# Altium schematic sheet Peripherals.SchDoc
size A
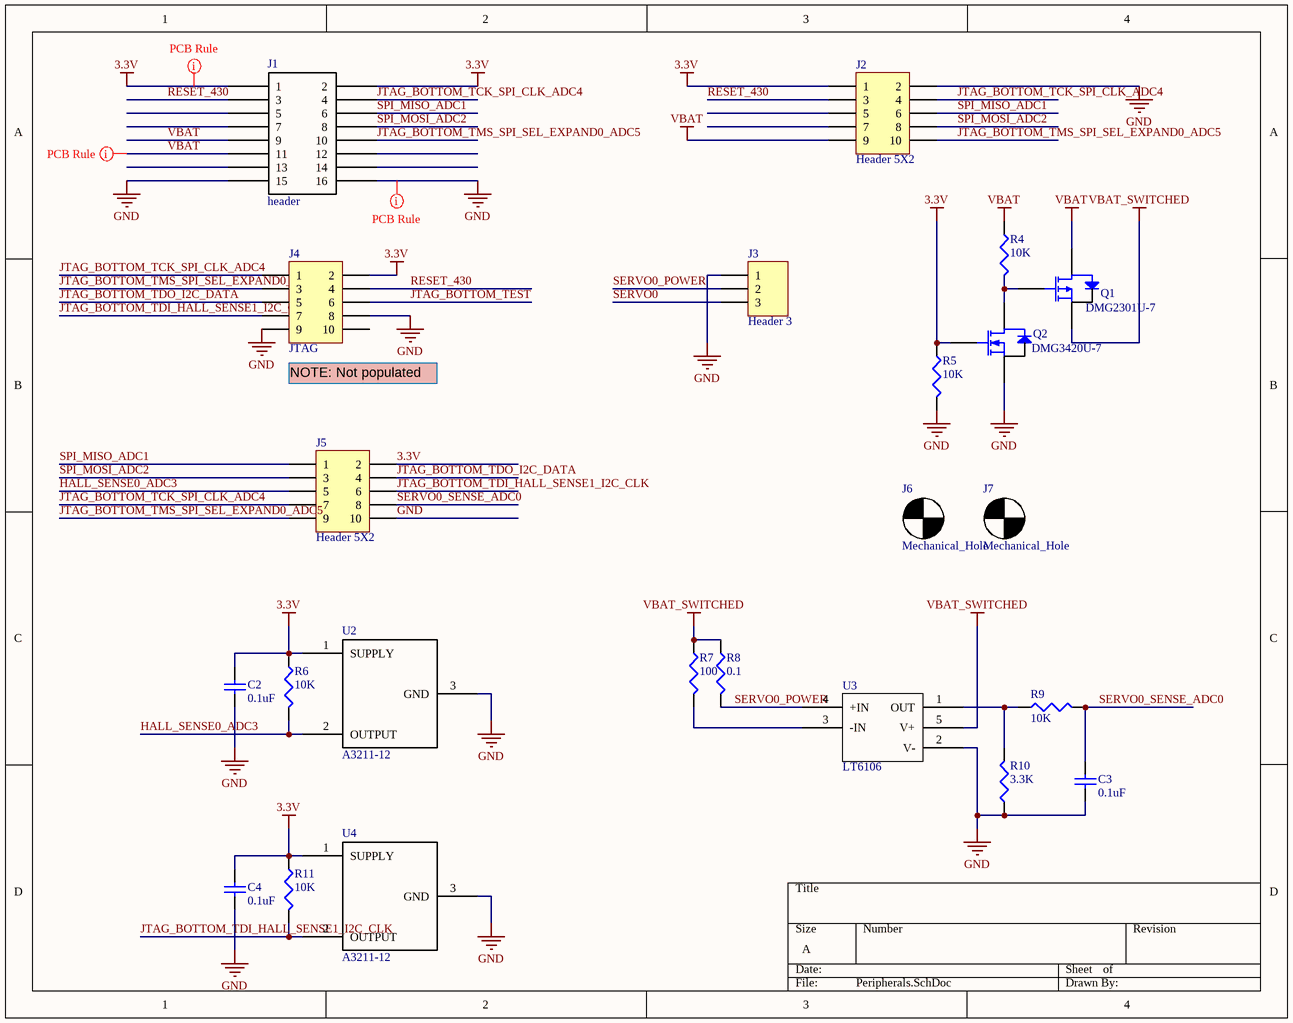
[diagram p0: Peripherals.SchDoc]

## Parts
C2  value 0.1uF  [CAPC1005L]  (hidden comment: Cap Semi)
C3  value 0.1uF  [CAPC1005L]  (hidden comment: Cap Semi)
C4  value 0.1uF  [CAPC1005L]  (hidden comment: Cap Semi)
J1  header  [HEADERSM 8X2]
J2  Header 5X2  [HDR2X5]
J3  Header 3  [HDR1X3]
J4  JTAG  [HDR2X5]
J5  Header 5X2  [HDR2X5]
J6  Mechanical_Hole  [#4_Screw_Hole]
J7  Mechanical_Hole  [#4_Screw_Hole]
Q1  DMG2301U-7  [SOT-23]
Q2  DMG3420U-7  [SOT-23]
R4  value 10K  [J1-0603]
R5  value 10K  [J1-0603]
R6  value 10K  [J1-0603]
R7  value 100  [J1-0603]  (hidden comment: R_IN)
R8  value 0.1  [J1-0603]  (hidden comment: RLOAD)
R9  value 10K  [J1-0603]  (hidden comment: LPF)
R10  value 3.3K  [J1-0603]  (hidden comment: R_OUT)
R11  value 10K  [J1-0603]
U2  A3211-12  [SOT-23 W]
U3  LT6106  [TSOT-23-5_LT6106]
U4  A3211-12  [SOT-23 W]

## Nets
3.3V: C2.2 C4.2 J1.1 J1.2 J2.1 J4.2 J5.2 Q2.1(G) R5.1 R6.1 R11.1 U2.1(SUPPLY) U4.1(SUPPLY)
GND: C2.1 C3.1 C4.1 J1.15 J1.16 J2.2 J3.1 J4.8 J4.9 J5.10 Q2.2(S) R5.2 R10.1 U2.3(GND) U3.2(V-) U4.3(GND)
VBAT: J1.9 J1.11 J2.9 Q1.3(D) R4.1
VBAT_SWITCHED: Q1.2(S) R7.1 R8.1 U3.5(V+)
HALL_SENSE0_ADC3: J5.5 R6.2 U2.2(OUTPUT)
JTAG_BOTTOM_TCK_SPI_CLK_ADC4: J1.4 J2.4 J4.1 J5.7
JTAG_BOTTOM_TDI_HALL_SENSE1_I2C_CLK: J4.7 J5.6 R11.2 U4.2(OUTPUT)
JTAG_BOTTOM_TDO_I2C_DATA: J4.5 J5.4
JTAG_BOTTOM_TEST: J4.6
JTAG_BOTTOM_TMS_SPI_SEL_EXPAND0_ADC5: J1.10 J2.10 J4.3 J5.9
RESET_430: J1.3 J2.3 J4.4
SERVO0: J3.3
SERVO0_POWER: J3.2 R8.2 U3.4(+IN)
SERVO0_SENSE_ADC0: C3.2 J5.8 R9.2
SPI_MISO_ADC1: J1.6 J2.6 J5.1
SPI_MOSI_ADC2: J1.8 J2.8 J5.3
NetQ1_1: Q1.1(G) Q2.3(D) R4.2
NetR7_2: R7.2 U3.3(-IN)
NetR9_1: R9.1 R10.2 U3.1(OUT)

Not connected (* = marked no-connect by the designer): J1 5 7 12 13 14; J2 5 7; J4 10

## Layout directives
rule Width Constraint [Pref Width = 20mil    Min Width = 10mil    Max Width = 25mil]: 3.3V, GND, VBAT

## Notes on the sheet
- (near J4) NOTE: Not populated

## Library data of the parts
C2-C4 = Cap Semi: Capacitor (Semiconductor SIM Model); Published: 8-Jun-2000; LatestRevisionDate: 29-May-2009; LatestRevisionNote: IPC-7351 Footprint Added.; PackageReference: C1206; Publisher: Altium Limited; PackageDescription: Chip Capacitor
J1 = HEADER 8X2
J2 J4 J5 = Header 5X2: Header, 5-Pin, Dual row; LatestRevisionDate: 17-Jul-2002; LatestRevisionNote: Re-released for DXP Platform.; Publisher: Altium Limited
J3 = Header 3: Header, 3-Pin; LatestRevisionDate: 17-Jul-2002; LatestRevisionNote: Re-released for DXP Platform.; Publisher: Altium Limited
J6 J7 = Mechanical_Hole: A mechanical hole for mounting the board
Q1 = P-Mosfet
Q2 = N-Mosfet
R4-R11 = Res3: Resistor; Published: 8-Jun-2000; LatestRevisionDate: 29-May-2009; LatestRevisionNote: IPC-7351 Footprint Added.; PackageReference: J1-0603; Publisher: Altium Limited; PackageDescription: Chip Resistor
U2 U4 = A311-12: Hall Effect Sensor
U3 = LT6106: Current Sense Amplifier